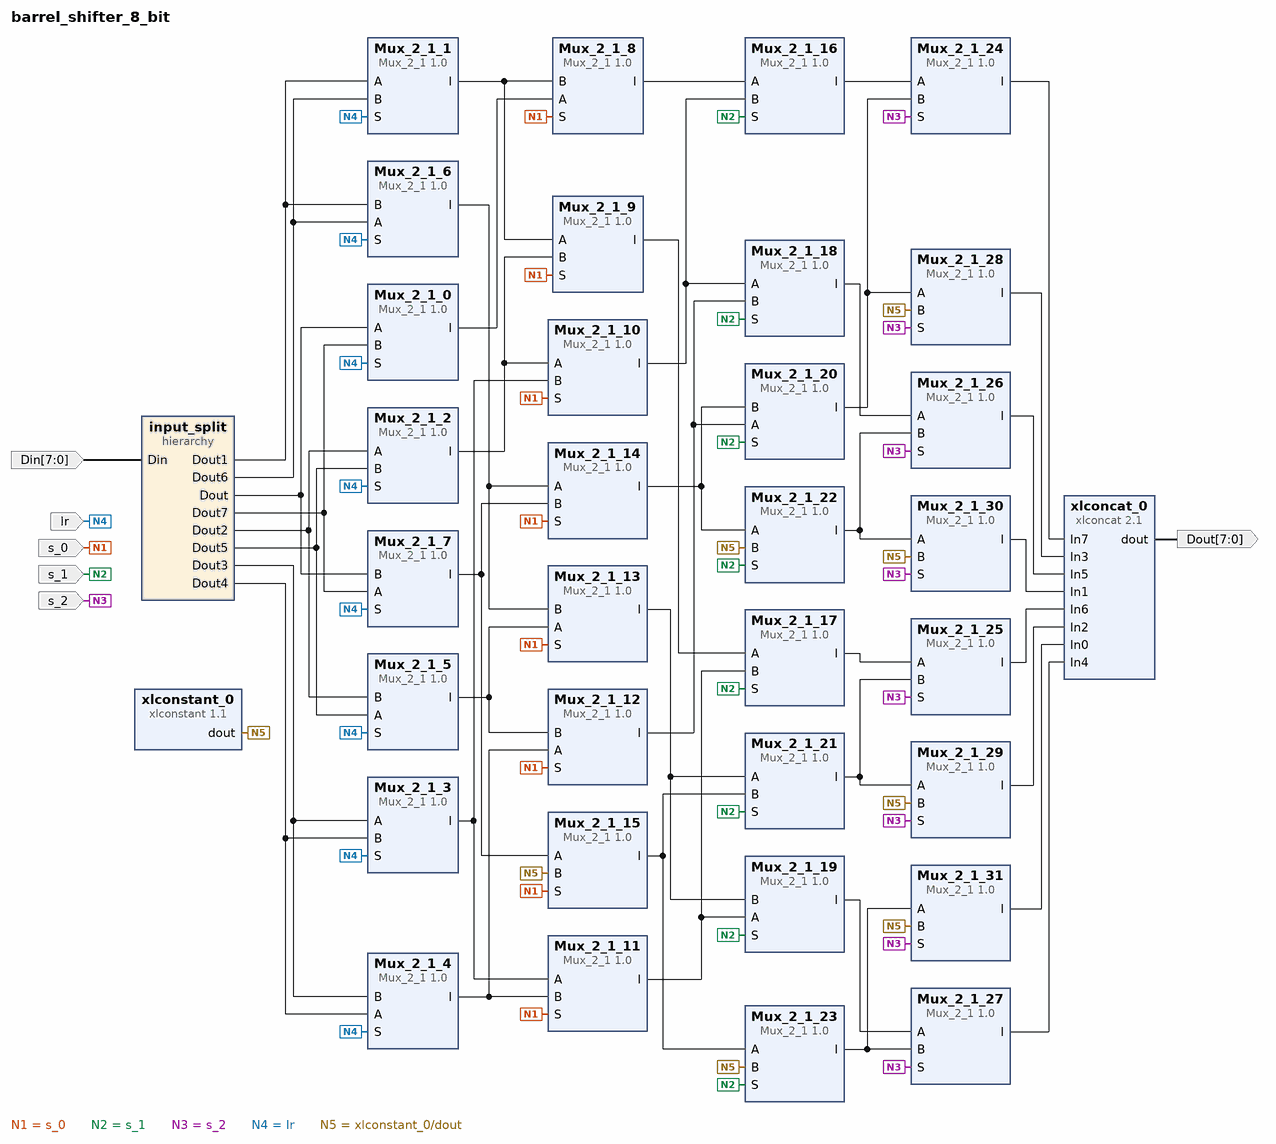
[diagram p0: block diagram of the top level]
# Vivado block design barrel_shifter_8_bit, xc7z010clg400-1, Vivado 2019.1
create_bd_design barrel_shifter_8_bit

create_bd_port -dir I -from 7 -to 0 -type data Din
create_bd_port -dir I lr
create_bd_port -dir O -from 7 -to 0 Dout
create_bd_port -dir I s_2
create_bd_port -dir I s_0
create_bd_port -dir I s_1

create_bd_cell -type ip -vlnv xilinx.com:user:Mux_2_1:1.0 Mux_2_1_0
create_bd_cell -type ip -vlnv xilinx.com:user:Mux_2_1:1.0 Mux_2_1_1
create_bd_cell -type ip -vlnv xilinx.com:user:Mux_2_1:1.0 Mux_2_1_2
create_bd_cell -type ip -vlnv xilinx.com:user:Mux_2_1:1.0 Mux_2_1_3
create_bd_cell -type ip -vlnv xilinx.com:user:Mux_2_1:1.0 Mux_2_1_4
create_bd_cell -type ip -vlnv xilinx.com:user:Mux_2_1:1.0 Mux_2_1_5
create_bd_cell -type ip -vlnv xilinx.com:user:Mux_2_1:1.0 Mux_2_1_6
create_bd_cell -type ip -vlnv xilinx.com:user:Mux_2_1:1.0 Mux_2_1_7
create_bd_cell -type ip -vlnv xilinx.com:user:Mux_2_1:1.0 Mux_2_1_8
create_bd_cell -type ip -vlnv xilinx.com:user:Mux_2_1:1.0 Mux_2_1_9
create_bd_cell -type ip -vlnv xilinx.com:user:Mux_2_1:1.0 Mux_2_1_10
create_bd_cell -type ip -vlnv xilinx.com:user:Mux_2_1:1.0 Mux_2_1_11
create_bd_cell -type ip -vlnv xilinx.com:user:Mux_2_1:1.0 Mux_2_1_12
create_bd_cell -type ip -vlnv xilinx.com:user:Mux_2_1:1.0 Mux_2_1_13
create_bd_cell -type ip -vlnv xilinx.com:user:Mux_2_1:1.0 Mux_2_1_14
create_bd_cell -type ip -vlnv xilinx.com:user:Mux_2_1:1.0 Mux_2_1_15
create_bd_cell -type ip -vlnv xilinx.com:user:Mux_2_1:1.0 Mux_2_1_16
create_bd_cell -type ip -vlnv xilinx.com:user:Mux_2_1:1.0 Mux_2_1_17
create_bd_cell -type ip -vlnv xilinx.com:user:Mux_2_1:1.0 Mux_2_1_18
create_bd_cell -type ip -vlnv xilinx.com:user:Mux_2_1:1.0 Mux_2_1_19
create_bd_cell -type ip -vlnv xilinx.com:user:Mux_2_1:1.0 Mux_2_1_20
create_bd_cell -type ip -vlnv xilinx.com:user:Mux_2_1:1.0 Mux_2_1_21
create_bd_cell -type ip -vlnv xilinx.com:user:Mux_2_1:1.0 Mux_2_1_22
create_bd_cell -type ip -vlnv xilinx.com:user:Mux_2_1:1.0 Mux_2_1_23
create_bd_cell -type ip -vlnv xilinx.com:user:Mux_2_1:1.0 Mux_2_1_24
create_bd_cell -type ip -vlnv xilinx.com:user:Mux_2_1:1.0 Mux_2_1_25
create_bd_cell -type ip -vlnv xilinx.com:user:Mux_2_1:1.0 Mux_2_1_26
create_bd_cell -type ip -vlnv xilinx.com:user:Mux_2_1:1.0 Mux_2_1_27
create_bd_cell -type ip -vlnv xilinx.com:user:Mux_2_1:1.0 Mux_2_1_28
create_bd_cell -type ip -vlnv xilinx.com:user:Mux_2_1:1.0 Mux_2_1_29
create_bd_cell -type ip -vlnv xilinx.com:user:Mux_2_1:1.0 Mux_2_1_30
create_bd_cell -type ip -vlnv xilinx.com:user:Mux_2_1:1.0 Mux_2_1_31
create_bd_cell -type ip -vlnv xilinx.com:ip:xlconstant:1.1 xlconstant_0
set_property -dict {CONFIG.CONST_VAL 0} [get_bd_cells xlconstant_0]
create_bd_cell -type hier input_split
create_bd_cell -type ip -vlnv xilinx.com:ip:xlconcat:2.1 xlconcat_0
set_property -dict {CONFIG.NUM_PORTS 8} [get_bd_cells xlconcat_0]

# ---- hierarchy /input_split ----
current_bd_instance /input_split
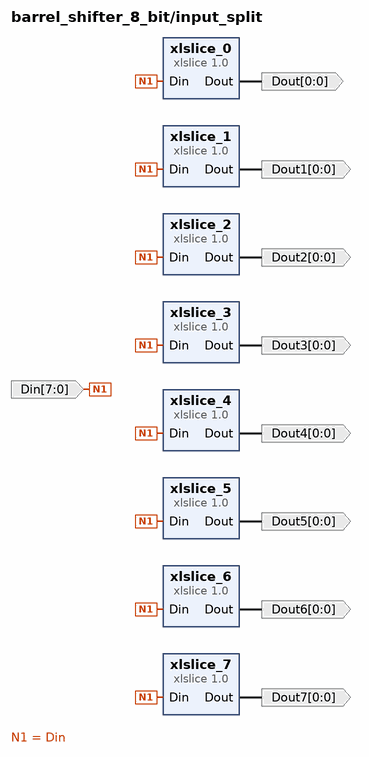
[diagram p1: block diagram inside /input_split]
create_bd_pin -dir I -from 7 -to 0 Din
create_bd_pin -dir O -from 0 -to 0 Dout
create_bd_pin -dir O -from 0 -to 0 Dout1
create_bd_pin -dir O -from 0 -to 0 Dout2
create_bd_pin -dir O -from 0 -to 0 Dout3
create_bd_pin -dir O -from 0 -to 0 Dout4
create_bd_pin -dir O -from 0 -to 0 Dout5
create_bd_pin -dir O -from 0 -to 0 Dout6
create_bd_pin -dir O -from 0 -to 0 Dout7

create_bd_cell -type ip -vlnv xilinx.com:ip:xlslice:1.0 xlslice_0
set_property -dict {CONFIG.DIN_FROM 7 CONFIG.DIN_TO 7 CONFIG.DIN_WIDTH 8 CONFIG.DOUT_WIDTH 1} [get_bd_cells xlslice_0]
create_bd_cell -type ip -vlnv xilinx.com:ip:xlslice:1.0 xlslice_1
set_property -dict {CONFIG.DIN_FROM 6 CONFIG.DIN_TO 6 CONFIG.DIN_WIDTH 8 CONFIG.DOUT_WIDTH 1} [get_bd_cells xlslice_1]
create_bd_cell -type ip -vlnv xilinx.com:ip:xlslice:1.0 xlslice_2
set_property -dict {CONFIG.DIN_FROM 5 CONFIG.DIN_TO 5 CONFIG.DIN_WIDTH 8 CONFIG.DOUT_WIDTH 1} [get_bd_cells xlslice_2]
create_bd_cell -type ip -vlnv xilinx.com:ip:xlslice:1.0 xlslice_3
set_property -dict {CONFIG.DIN_FROM 4 CONFIG.DIN_TO 4 CONFIG.DIN_WIDTH 8 CONFIG.DOUT_WIDTH 1} [get_bd_cells xlslice_3]
create_bd_cell -type ip -vlnv xilinx.com:ip:xlslice:1.0 xlslice_4
set_property -dict {CONFIG.DIN_FROM 3 CONFIG.DIN_TO 3 CONFIG.DIN_WIDTH 8 CONFIG.DOUT_WIDTH 1} [get_bd_cells xlslice_4]
create_bd_cell -type ip -vlnv xilinx.com:ip:xlslice:1.0 xlslice_5
set_property -dict {CONFIG.DIN_FROM 2 CONFIG.DIN_TO 2 CONFIG.DIN_WIDTH 8 CONFIG.DOUT_WIDTH 1} [get_bd_cells xlslice_5]
create_bd_cell -type ip -vlnv xilinx.com:ip:xlslice:1.0 xlslice_6
set_property -dict {CONFIG.DIN_FROM 1 CONFIG.DIN_TO 1 CONFIG.DIN_WIDTH 8 CONFIG.DOUT_WIDTH 1} [get_bd_cells xlslice_6]
create_bd_cell -type ip -vlnv xilinx.com:ip:xlslice:1.0 xlslice_7
set_property -dict {CONFIG.DIN_FROM 0 CONFIG.DIN_TO 0 CONFIG.DIN_WIDTH 8 CONFIG.DOUT_WIDTH 1} [get_bd_cells xlslice_7]

# ---- connections ----

current_bd_instance /input_split
connect_bd_net [get_bd_pins Din] \
  [get_bd_pins xlslice_1/Din] [get_bd_pins xlslice_2/Din] [get_bd_pins xlslice_3/Din] [get_bd_pins xlslice_4/Din] \
  [get_bd_pins xlslice_5/Din] [get_bd_pins xlslice_6/Din] [get_bd_pins xlslice_7/Din] [get_bd_pins xlslice_0/Din]
connect_bd_net [get_bd_pins xlslice_0/Dout] [get_bd_pins Dout]
connect_bd_net [get_bd_pins xlslice_1/Dout] [get_bd_pins Dout1]
connect_bd_net [get_bd_pins xlslice_2/Dout] [get_bd_pins Dout2]
connect_bd_net [get_bd_pins xlslice_3/Dout] [get_bd_pins Dout3]
connect_bd_net [get_bd_pins xlslice_4/Dout] [get_bd_pins Dout4]
connect_bd_net [get_bd_pins xlslice_5/Dout] [get_bd_pins Dout5]
connect_bd_net [get_bd_pins xlslice_6/Dout] [get_bd_pins Dout6]
connect_bd_net [get_bd_pins xlslice_7/Dout] [get_bd_pins Dout7]

current_bd_instance /
connect_bd_net [get_bd_pins Mux_2_1_15/I] [get_bd_pins Mux_2_1_23/A] [get_bd_pins Mux_2_1_21/B]
connect_bd_net [get_bd_pins Mux_2_1_14/I] [get_bd_pins Mux_2_1_22/A] [get_bd_pins Mux_2_1_20/B]
connect_bd_net [get_bd_pins Mux_2_1_13/I] [get_bd_pins Mux_2_1_21/A] [get_bd_pins Mux_2_1_19/B]
connect_bd_net [get_bd_pins Mux_2_1_12/I] [get_bd_pins Mux_2_1_20/A] [get_bd_pins Mux_2_1_18/B]
connect_bd_net [get_bd_pins Mux_2_1_11/I] [get_bd_pins Mux_2_1_19/A] [get_bd_pins Mux_2_1_17/B]
connect_bd_net [get_bd_pins Mux_2_1_10/I] [get_bd_pins Mux_2_1_18/A] [get_bd_pins Mux_2_1_16/B]
connect_bd_net [get_bd_pins Mux_2_1_8/I] [get_bd_pins Mux_2_1_16/A]
connect_bd_net [get_bd_pins Mux_2_1_16/I] [get_bd_pins Mux_2_1_24/A]
connect_bd_net [get_bd_pins Mux_2_1_17/I] [get_bd_pins Mux_2_1_25/A]
connect_bd_net [get_bd_pins Mux_2_1_18/I] [get_bd_pins Mux_2_1_26/A]
connect_bd_net [get_bd_pins Mux_2_1_19/I] [get_bd_pins Mux_2_1_27/A]
connect_bd_net [get_bd_pins Mux_2_1_20/I] [get_bd_pins Mux_2_1_28/A] [get_bd_pins Mux_2_1_24/B]
connect_bd_net [get_bd_pins Mux_2_1_21/I] [get_bd_pins Mux_2_1_29/A] [get_bd_pins Mux_2_1_25/B]
connect_bd_net [get_bd_pins Mux_2_1_22/I] [get_bd_pins Mux_2_1_30/A] [get_bd_pins Mux_2_1_26/B]
connect_bd_net [get_bd_pins Mux_2_1_23/I] [get_bd_pins Mux_2_1_31/A] [get_bd_pins Mux_2_1_27/B]
connect_bd_net [get_bd_pins Mux_2_1_7/I] [get_bd_pins Mux_2_1_15/A] [get_bd_pins Mux_2_1_14/B]
connect_bd_net [get_bd_pins Mux_2_1_6/I] [get_bd_pins Mux_2_1_14/A] [get_bd_pins Mux_2_1_13/B]
connect_bd_net [get_bd_pins Mux_2_1_5/I] [get_bd_pins Mux_2_1_13/A] [get_bd_pins Mux_2_1_12/B]
connect_bd_net [get_bd_pins Mux_2_1_4/I] [get_bd_pins Mux_2_1_12/A] [get_bd_pins Mux_2_1_11/B]
connect_bd_net [get_bd_pins Mux_2_1_3/I] [get_bd_pins Mux_2_1_11/A] [get_bd_pins Mux_2_1_10/B]
connect_bd_net [get_bd_pins Mux_2_1_2/I] [get_bd_pins Mux_2_1_10/A] [get_bd_pins Mux_2_1_9/B]
connect_bd_net [get_bd_pins Mux_2_1_1/I] [get_bd_pins Mux_2_1_9/A] [get_bd_pins Mux_2_1_8/B]
connect_bd_net [get_bd_pins Mux_2_1_0/I] [get_bd_pins Mux_2_1_8/A]
connect_bd_net [get_bd_ports s_0] \
  [get_bd_pins Mux_2_1_9/S] [get_bd_pins Mux_2_1_8/S] [get_bd_pins Mux_2_1_10/S] [get_bd_pins Mux_2_1_11/S] \
  [get_bd_pins Mux_2_1_12/S] [get_bd_pins Mux_2_1_13/S] [get_bd_pins Mux_2_1_14/S] [get_bd_pins Mux_2_1_15/S]
connect_bd_net [get_bd_ports s_1] \
  [get_bd_pins Mux_2_1_16/S] [get_bd_pins Mux_2_1_17/S] [get_bd_pins Mux_2_1_18/S] [get_bd_pins Mux_2_1_19/S] \
  [get_bd_pins Mux_2_1_20/S] [get_bd_pins Mux_2_1_23/S] [get_bd_pins Mux_2_1_22/S] [get_bd_pins Mux_2_1_21/S]
connect_bd_net [get_bd_ports s_2] \
  [get_bd_pins Mux_2_1_24/S] [get_bd_pins Mux_2_1_25/S] [get_bd_pins Mux_2_1_26/S] [get_bd_pins Mux_2_1_27/S] \
  [get_bd_pins Mux_2_1_28/S] [get_bd_pins Mux_2_1_29/S] [get_bd_pins Mux_2_1_30/S] [get_bd_pins Mux_2_1_31/S]
connect_bd_net [get_bd_ports lr] \
  [get_bd_pins Mux_2_1_7/S] [get_bd_pins Mux_2_1_6/S] [get_bd_pins Mux_2_1_5/S] [get_bd_pins Mux_2_1_4/S] \
  [get_bd_pins Mux_2_1_3/S] [get_bd_pins Mux_2_1_2/S] [get_bd_pins Mux_2_1_1/S] [get_bd_pins Mux_2_1_0/S]
connect_bd_net [get_bd_pins Mux_2_1_9/I] [get_bd_pins Mux_2_1_17/A]
connect_bd_net [get_bd_pins xlconstant_0/dout] \
  [get_bd_pins Mux_2_1_23/B] [get_bd_pins Mux_2_1_22/B] [get_bd_pins Mux_2_1_31/B] [get_bd_pins Mux_2_1_30/B] \
  [get_bd_pins Mux_2_1_29/B] [get_bd_pins Mux_2_1_28/B] [get_bd_pins Mux_2_1_15/B]
connect_bd_net [get_bd_ports Din] [get_bd_pins input_split/Din]
connect_bd_net -net xlslice_0_Dout [get_bd_pins input_split/Dout] [get_bd_pins Mux_2_1_0/A] [get_bd_pins Mux_2_1_7/B]
connect_bd_net -net xlslice_1_Dout [get_bd_pins input_split/Dout1] [get_bd_pins Mux_2_1_1/A] [get_bd_pins Mux_2_1_6/B]
connect_bd_net -net xlslice_2_Dout [get_bd_pins input_split/Dout2] [get_bd_pins Mux_2_1_2/A] [get_bd_pins Mux_2_1_5/B]
connect_bd_net -net xlslice_3_Dout [get_bd_pins input_split/Dout3] [get_bd_pins Mux_2_1_3/A] [get_bd_pins Mux_2_1_4/B]
connect_bd_net -net xlslice_5_Dout [get_bd_pins input_split/Dout5] [get_bd_pins Mux_2_1_5/A] [get_bd_pins Mux_2_1_2/B]
connect_bd_net -net xlslice_6_Dout [get_bd_pins input_split/Dout6] [get_bd_pins Mux_2_1_6/A] [get_bd_pins Mux_2_1_1/B]
connect_bd_net -net xlslice_7_Dout [get_bd_pins input_split/Dout7] [get_bd_pins Mux_2_1_7/A] [get_bd_pins Mux_2_1_0/B]
connect_bd_net -net xlslice_4_Dout [get_bd_pins input_split/Dout4] [get_bd_pins Mux_2_1_4/A] [get_bd_pins Mux_2_1_3/B]
connect_bd_net [get_bd_pins Mux_2_1_24/I] [get_bd_pins xlconcat_0/In7]
connect_bd_net [get_bd_pins Mux_2_1_25/I] [get_bd_pins xlconcat_0/In6]
connect_bd_net [get_bd_pins Mux_2_1_26/I] [get_bd_pins xlconcat_0/In5]
connect_bd_net [get_bd_pins Mux_2_1_27/I] [get_bd_pins xlconcat_0/In4]
connect_bd_net [get_bd_pins Mux_2_1_28/I] [get_bd_pins xlconcat_0/In3]
connect_bd_net [get_bd_pins Mux_2_1_29/I] [get_bd_pins xlconcat_0/In2]
connect_bd_net [get_bd_pins Mux_2_1_30/I] [get_bd_pins xlconcat_0/In1]
connect_bd_net [get_bd_pins Mux_2_1_31/I] [get_bd_pins xlconcat_0/In0]
connect_bd_net [get_bd_pins xlconcat_0/dout] [get_bd_ports Dout]

validate_bd_design
save_bd_design
